# EAGLE schematic Enclosure 100x68 PCB Outline (EAGLE 9.6.2)
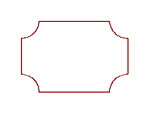
[diagram p0: schematic, sheet 1]

## Parts
U$2  PCB-OUTLINE-100X68-RAW  [PROTO-100X68-OUTLINE]

## Library data of the parts
U$2 = digitalconcepts:PCB-OUTLINE-100X68-RAW: 100 x 68 Enclosure PCB Outline